# EAGLE design Shield_IPS_Color_Display (EAGLE 9.6.2)
COMPANY: Unexpected Maker; DATE: 24-10-2018; DRAWN: Seon; REV: V1; TITLE: TinyPICO
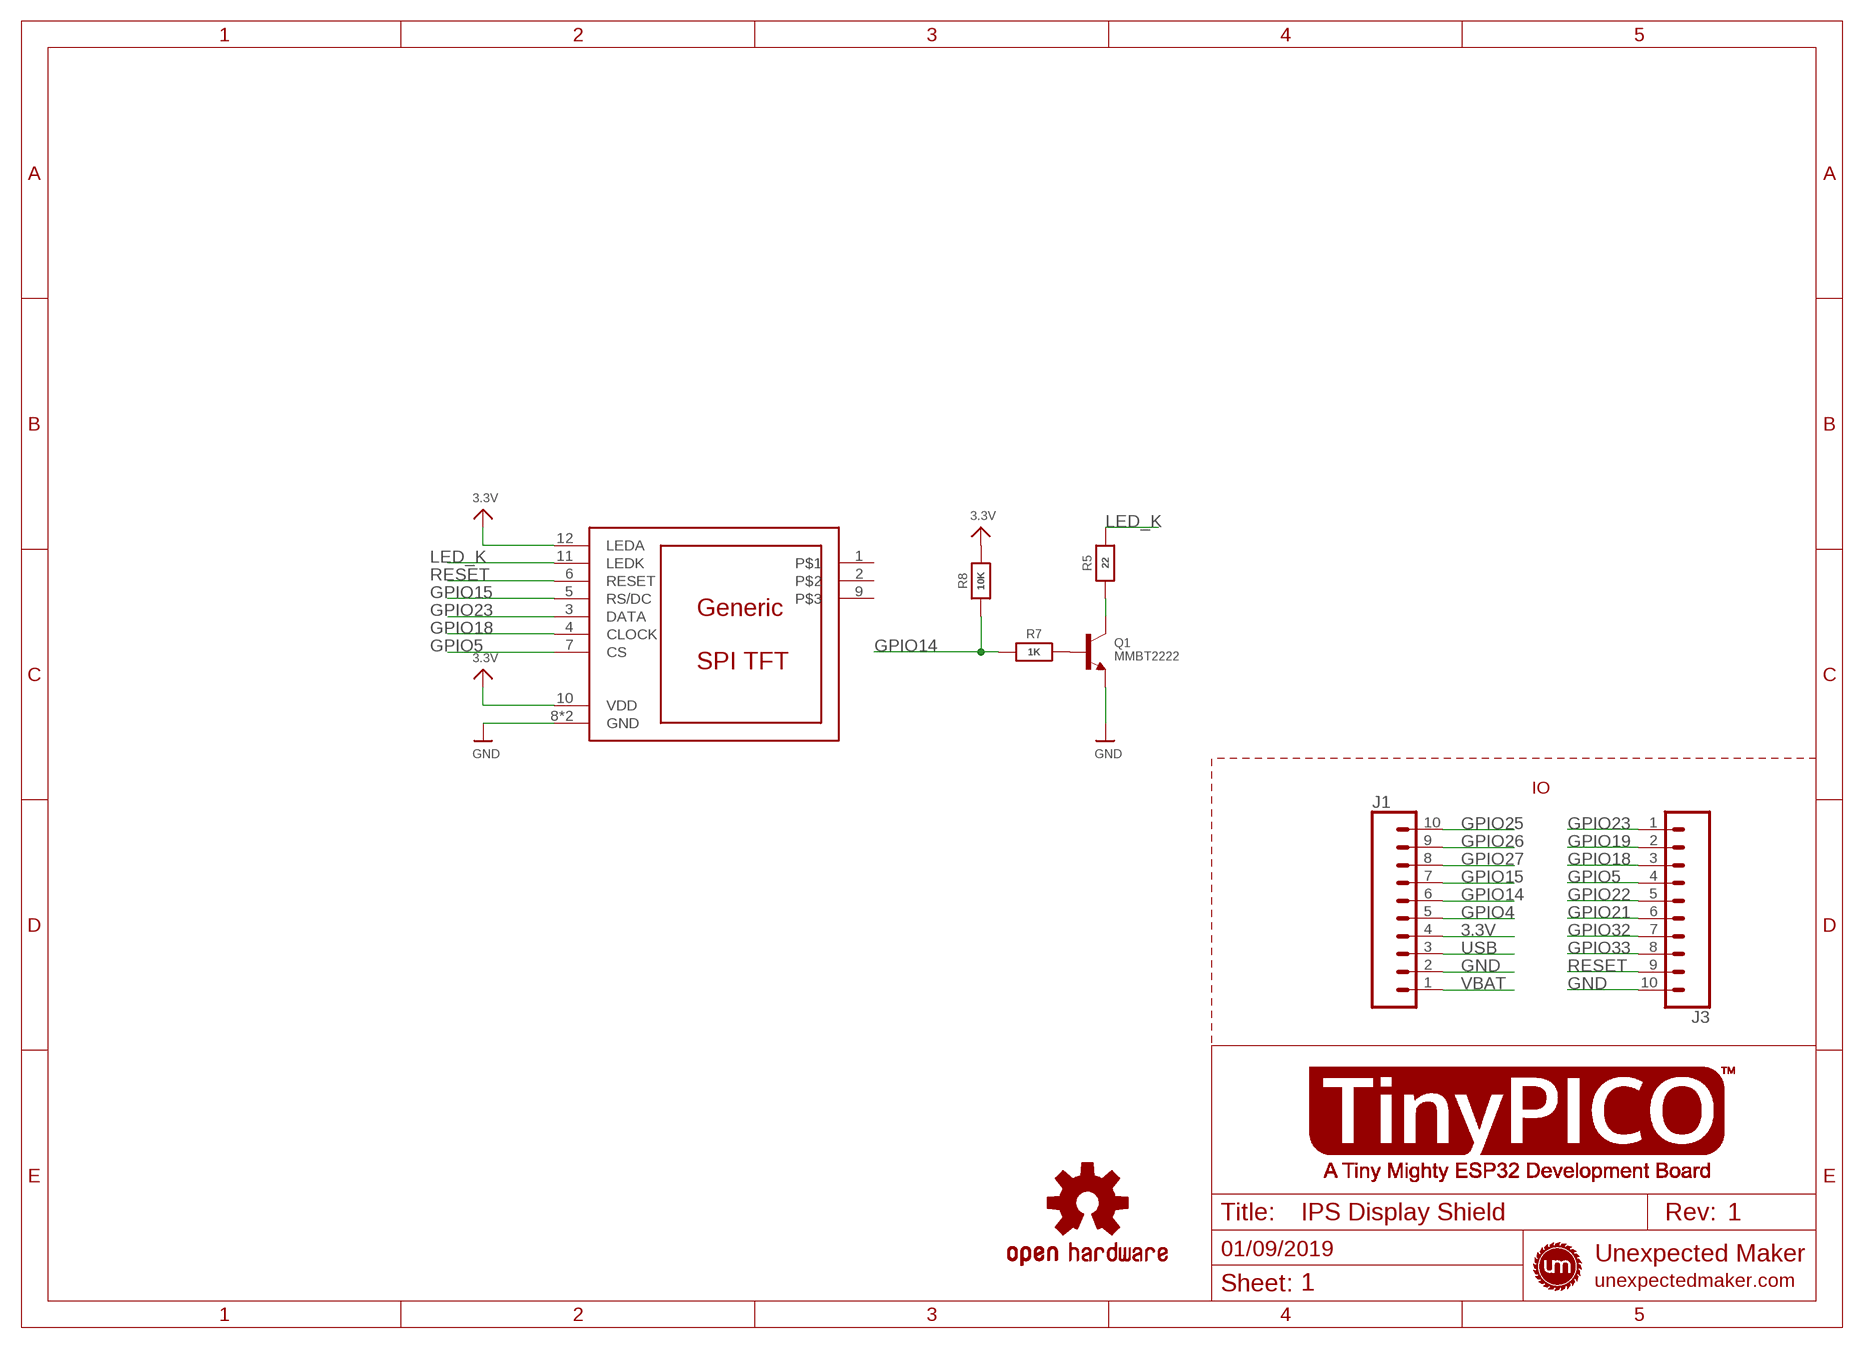
[diagram p0: schematic, sheet 1]
FRAME2 (FRAME_A4_TINYPICO): CDATE: 01/09/2019; REV: 1; SHEET_NUM: 1; TITLE: IPS Display Shield

## Parts
J1  TINYPICO_HEADER_10SQR  [1X10_NO_SILK_SQR]
J3  TINYPICO_HEADER_10SQR  [1X10_NO_SILK_SQR]
LOGO1  OSHW-LOGOS  [OSHW-LOGO-S]
Q1  MMBT2222  TRANSISTOR_NPNWIDE  [SOT23-WIDE]
R5  22  RESISTOR_0603MP  [_0603MP]
R7  1K  RESISTOR_0603MP  [_0603MP]
R8  10K  RESISTOR_0603MP  [_0603MP]
U$2  MICROBUILDER_DISP_LCD_0.9IN_160X80  [MICROBUILDER_TFT_0.96IN_160X80]

## Nets
3.3V: J1.4 R8.2 U$2.10(VDD) U$2.12(LEDA)
GND: J1.2 J3.10 Q1.2(E) U$2.8(GND) U$2.13(GND)
GPIO4: J1.5
GPIO5: J3.4 U$2.7(CS)
GPIO14: J1.6 R7.1 R8.1
GPIO15: J1.7 U$2.5(RS/DC)
GPIO18: J3.3 U$2.4(CLOCK)
GPIO19: J3.2
GPIO21: J3.6
GPIO22: J3.5
GPIO23: J3.1 U$2.3(DATA)
GPIO25: J1.10
GPIO26: J1.9
GPIO27: J1.8
GPIO32: J3.7
GPIO33: J3.8
LED_K: R5.2 U$2.11(LEDK)
N$1: Q1.1(B) R7.2
N$5: Q1.3(C) R5.1
RESET: J3.9 U$2.6(RESET)
USB: J1.3
VBAT: J1.1
Unconnected: U$2.1 U$2.2 U$2.9

## Notes on the sheet
- IO

## Library data of the parts
J1 J3 = UnexpectedMaker:TINYPICO_HEADER_10: Multi connection point. Often used as Generic Header-pin footprint for 0.1 inch spaced/style header connections On any of the 0.1 inch spaced packages, you can populate with these: Break Away Headers - Straight <https://www.sparkfun.com/products/116> (PRT-00116) Break Away Male Headers - Right Angle <https://www.sparkfun.com/products/553> (PRT-00553) Female Headers <https://www.sparkfun.com/products/115> (PRT-00115) Break Away Headers - Machine Pin <https://www.sparkfun.com/products/117> (PRT-00117) Break Away Female Headers - Swiss Machine Pin <https://www.sparkfun.com/products/743> (PRT-00743) Arduino Stackable Header - 10 Pin <https://www.sparkfun.com/products/11376> (PRT-11376) For SCREWTERMINALS and SPRING TERMINALS visit here: Screw Terimnals on SparkFun.com <https://www.sparkfun.com/search/results?term=Screw+Terminals> (5mm/3.5mm/2.54mm spacing) This device is also useful as a general connection point to wire up your design to another part of your project. Our various solder wires solder well into these plated through hole pads. Hook-Up Wire - Assortment (Stranded, 22 AWG) <https://www.sparkfun.com/products/11375> (PRT-11375) Hook-Up Wire - Assortment (Solid Core, 22 AWG) <https://www.sparkfun.com/products/11367> (PRT-11367) View the entire wire category on our website here <https://www.sparkfun.com/categories/141> Special notes: Molex polarized connector foot print use with SKU : PRT-08231 with associated crimp pins and housings. 1MM SMD Version SKU: PRT-10208 NOTES ON THE VARIANTS LOCK and LOCK_LONGPADS... This footprint was designed to help hold the alignment of a through-hole component (i.e. 6-pin header) while soldering it into place. You may notice that each hole has been shifted either up or down by 0.005 of an inch from it's more standard position (which is a perfectly straight line). This slight alteration caused the pins (the squares in the middle) to touch the edges of the holes. Because they are alternating, it causes a "brace" to hold the component in place. 0.005 has proven to be the perfect amount of "off-center" position when using our standard breakaway headers. Although looks a little odd when you look at the bare footprint, once you have a header in there, the alteration is very hard to notice. Also,if you push a header all the way into place, it is covered up entirely on the bottom side.
LOGO1 = SparkFun-Aesthetics:OSHW-LOGO: Open-Source Hardware (OSHW) Logo This logo indicates the piece of hardware it is found on incorporates a OSHW license and/or adheres to the definition of open source hardware found here: http://freedomdefined.org/OSHW
Q1 = microbuilder:TRANSISTOR_NPN: NPN Transistor Transistor (NPN) 500mA 45V - BC817 [Digikey: 568-1631-1-ND] Transistor (NPN) 500mA 45V - BC817,215 [Mouser: 771-BC817-T/R] SOT23-R - SOT23 footprint optimised for use with solder paste and reflow ovens. SOT23-W - SOT23 footprint optimised for hand-soldering (larger pads).
R5 R7 R8 = microbuilder:RESISTOR: Resistors For new designs, use the packages preceded by an '_' character since they are more reliable: The following footprints should be used on most boards: _0402 - Standard footprint for regular board layouts _0603 - Standard footprint for regular board layouts _0805 - Standard footprint for regular board layouts _1206 - Standard footprint for regular board layouts For extremely tight-pitch boards where space is at a premium, the following 'micro-pitch' footprints can be used (smaller pads, no silkscreen outline, etc.): _0402MP - Micro-pitch footprint for very dense/compact boards _0603MP - Micro-pitch footprint for very dense/compact boards _0805MP - Micro-pitch footprint for very dense/compact boards _1206MP - Micro-pitch footprint for very dense/compact boards
U$2 = UnexpectedMaker:MICROBUILDER_DISP_LCD_0.9IN_160X80

## Board
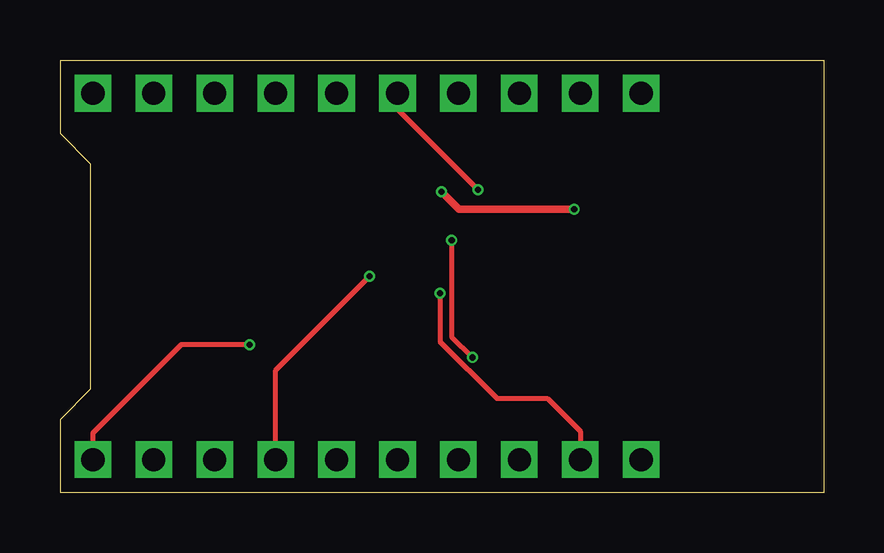
[diagram p1: board, top side]
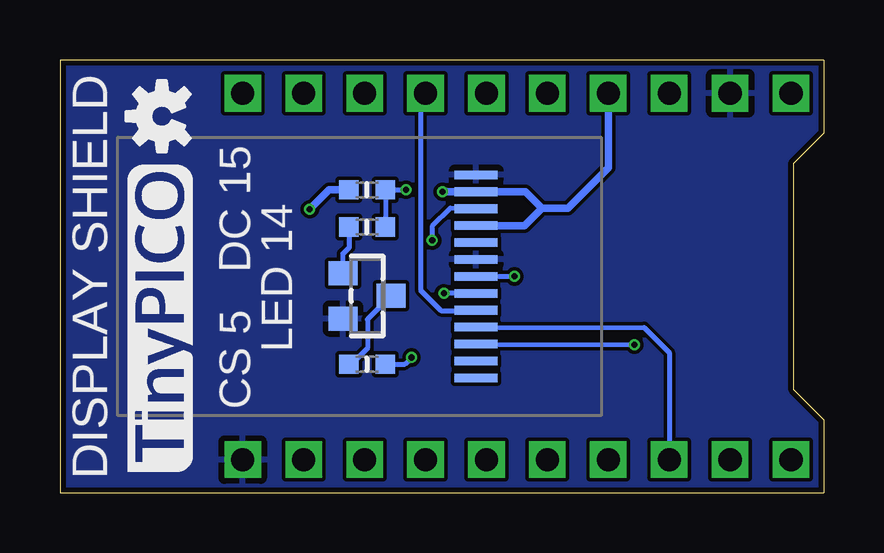
[diagram p2: board, bottom side, seen from below]

Size 31.85 x 18.03 mm. Coordinates in mm from the lower left corner, seen from the top.
Outline: 31.85,0 0,0 0,3.05 1.27,4.32 1.27,13.72 0,14.99 0,18.03 31.85,18.03 31.85,0
Copper layers (1*16): Top 0.035mm / dielectric 1.5mm / Bottom 0.035mm
Design rules "UnexpectedMaker_JLCPCB 2 Layer": minimum track width 6mil, minimum drill 10mil, track to track 6mil, track to pad 6mil, pad to pad 6mil, via to via 6mil, smd to smd 6mil, copper to edge 9mil, drill to drill 7mil, minimum pad ring 4mil, minimum via ring 4mil, stop-mask expansion 4mil, vias tented up to drill 25mil, thermal gap 10mil

### Footprints (pad centres in the part's own frame; a part is rotated, then mirrored left to right if it is on the bottom)
1X10_NO_SILK_SQR = drill 0.965 pad 1.524 square: 1 0,0; 2 2.54,0; 3 5.08,0; 4 7.62,0; 5 10.16,0; 6 12.7,0; 7 15.24,0; 8 17.78,0; 9 20.32,0; 10 22.86,0
SOT23-WIDE = smd 1 x 1.2: 1 -0.95,-1; 2 0.95,-1; 3 0,1
_0603MP = smd 0.8 x 0.8: 1 -0.762,0; 2 0.762,0
MICROBUILDER_TFT_0.96IN_160X80 = smd 0.36 x 1.79: 1 -4.23,-0.1; 2 -3.525,-0.1; 3 -2.82,-0.1; 4 -2.115,-0.1; 5 -1.41,-0.1; 6 -0.705,-0.1; 7 0,-0.1; 8 0.705,-0.1; 9 1.41,-0.1; 10 2.115,-0.1; 11 2.82,-0.1; 12 3.525,-0.1; 13 4.23,-0.1

### Placement (x,y rotation side)
J1  1.37,16.65 0 top
J3  1.37,1.38 0 top
LOGO1  27.6,15.69 90 bottom
Q1  19.05,8.2 270 bottom
R5  19.05,5.36 0 bottom
R7  19.05,11.07 180 bottom
R8  19.05,12.62 180 bottom
U$2  14.61,9.02 90 bottom

### Tracks (layer width: path | path; a pad name or v marks a point on that pad's centre or on a via)
3.3V  (via drill 0.25)
  Top 0.305: v15.9,12.55 16.64,11.81 v21.44,11.81
  Bottom 0.305: J1.4 8.99,13.54 10.67,11.86 11.76,11.86 | R8.2 20.62,12.62 v21.44,11.81 | v15.9,12.55 14.61,12.55 U$2.12 12.44,12.54 11.76,11.86 | U$2.10 12.49,11.13 11.76,11.86
GND
  pour Bottom: 32.38,18.54 32.38,-0.51 -1.27,-0.51 -1.27,18.54
GPIO5  (via drill 0.25)
  Top 0.203: J3.4 8.99,5.1 v12.9,9.02
  Bottom 0.203: U$2.7 v12.9,9.02
GPIO14  (via drill 0.25)
  Top 0.203: v17.42,12.62 14.07,15.98 J1.6
  Bottom 0.203: R7.1 R8.1 v17.42,12.62
GPIO15
  Bottom 0.203: J1.7 16.82,16.45 16.82,8.44 15.97,7.59 14.22,7.59 14.38,7.61 U$2.5
GPIO18
  Bottom 0.203: J3.3 6.45,5.84 7.5,6.89 U$2.4
GPIO23  (via drill 0.25)
  Top 0.203: J3.1 1.37,2.49 5.05,6.17 v7.9,6.17
  Bottom 0.203: U$2.3 v7.9,6.17
LED_K  (via drill 0.25)
  Top 0.203: v16.33,10.52 16.33,6.5 v17.2,5.64
  Bottom 0.203: v17.2,5.64 17.48,5.36 R5.2 | U$2.11 15.57,11.86 16.33,11.1 v16.33,10.52
N$1
  Bottom 0.203: Q1.1 20.05,9.97 19.8,10.22 19.8,11.06 R7.2
N$5
  Bottom 0.203: Q1.3 19.03,7.22 19.03,6.02 19.58,5.47 R5.1
RESET  (via drill 0.25)
  Top 0.203: v15.85,8.31 15.85,6.3 18.21,3.94 20.32,3.94 21.69,2.57 J3.9
  Bottom 0.203: U$2.6 v15.84,8.31 v15.85,8.31

### Text on the board
bPlace: CS 5 DC 15 / LED 14 | DISPLAY SHIELD